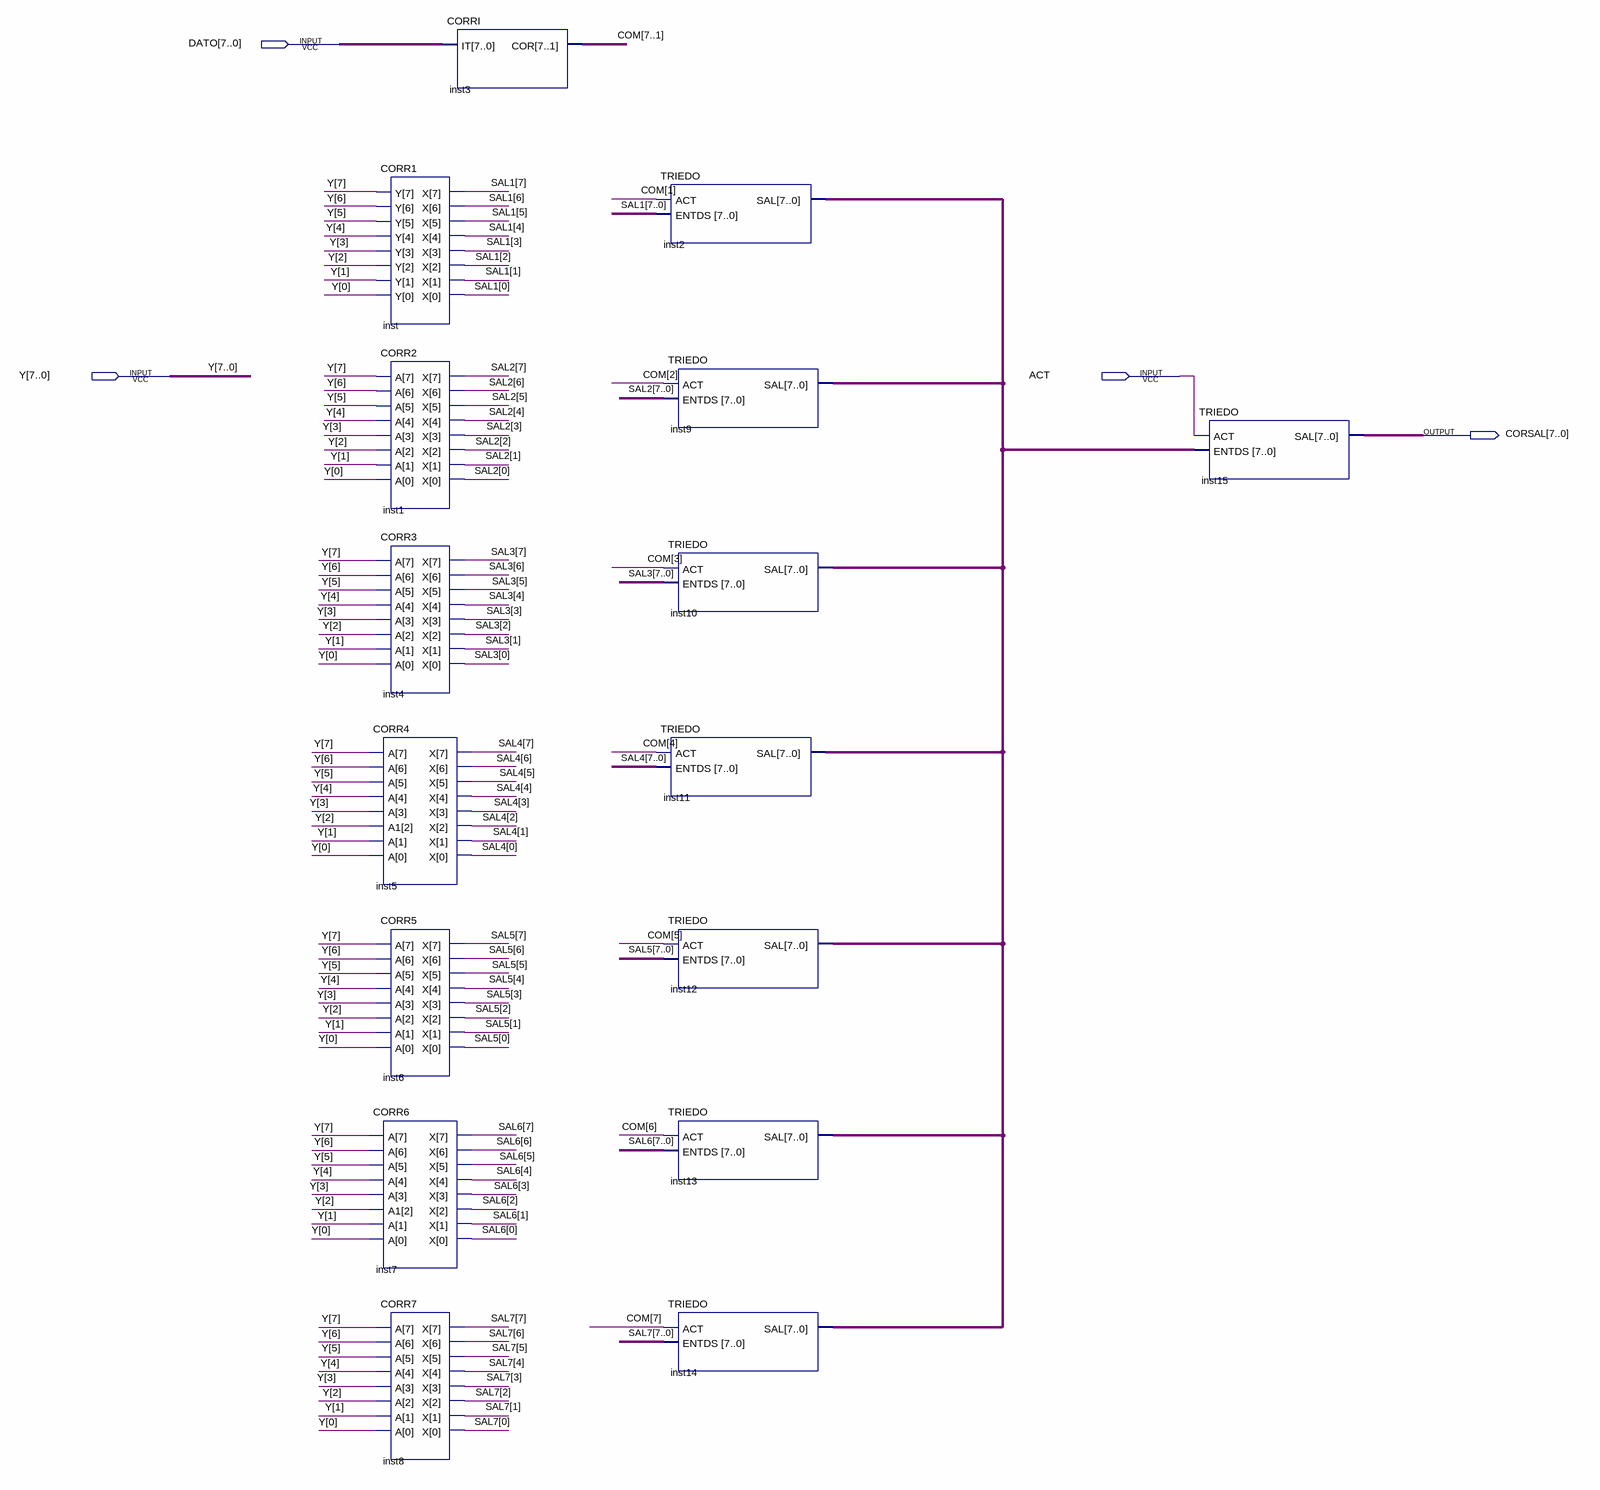
[diagram p0: schematic sheet]
// Quartus schematic CORRIMIENTO.bdf as structural Verilog: 16 symbols, 4 pins
module CORRIMIENTO (
  input  [7:0] DATO,
  input  [7:0] Y,
  input  ACT,
  output [7:0] CORSAL
);

  wire [7:0] inst2_sal, SAL1, SAL2, SAL3, SAL4, SAL5, SAL6, SAL7;
  wire [7:1] COM;

  CORR1 inst (.Y(Y), .X(SAL1));
  CORR2 inst1 (.A(Y), .X(SAL2));
  CORR3 inst4 (.A(Y), .X(SAL3));
  CORR4 inst5 (.A({Y[7:3], Y[1:0]}), .A1(Y[2]), .X(SAL4));
  CORR5 inst6 (.A(Y), .X(SAL5));
  CORR6 inst7 (.A({Y[7:3], Y[1:0]}), .A1(Y[2]), .X(SAL6));
  CORR7 inst8 (.A(Y), .X(SAL7));
  CORRI inst3 (.IT(DATO), .COR(COM));
  TRIEDO inst2 (.ACT(COM[1]), .ENTDS(SAL1), .SAL(inst2_sal));
  TRIEDO inst9 (.ACT(COM[2]), .ENTDS(SAL2), .SAL(inst2_sal));
  TRIEDO inst10 (.ACT(COM[3]), .ENTDS(SAL3), .SAL(inst2_sal));
  TRIEDO inst11 (.ACT(COM[4]), .ENTDS(SAL4), .SAL(inst2_sal));
  TRIEDO inst12 (.ACT(COM[5]), .ENTDS(SAL5), .SAL(inst2_sal));
  TRIEDO inst13 (.ACT(COM[6]), .ENTDS(SAL6), .SAL(inst2_sal));
  TRIEDO inst14 (.ACT(COM[7]), .ENTDS(SAL7), .SAL(inst2_sal));
  TRIEDO inst15 (.ACT(ACT), .ENTDS(inst2_sal), .SAL(CORSAL));
endmodule
